# Altium schematic sheet RP2040 MCU.SchDoc
size A2; SheetNumber: 5; SheetTotal: 13
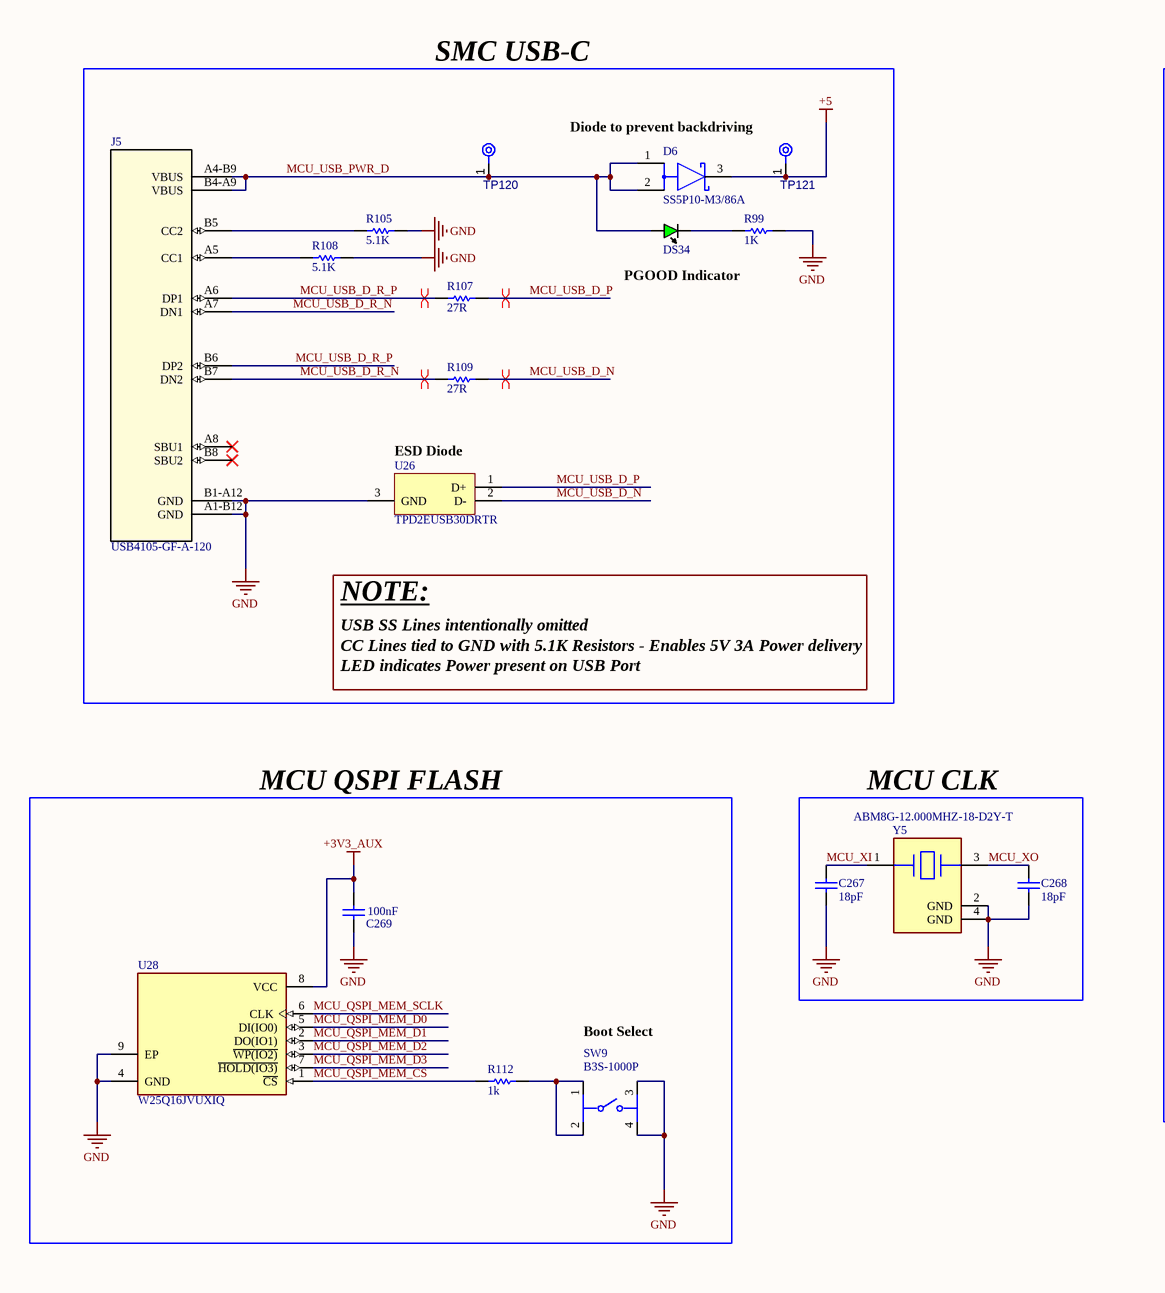
[diagram p0: RP2040 MCU.SchDoc, left]
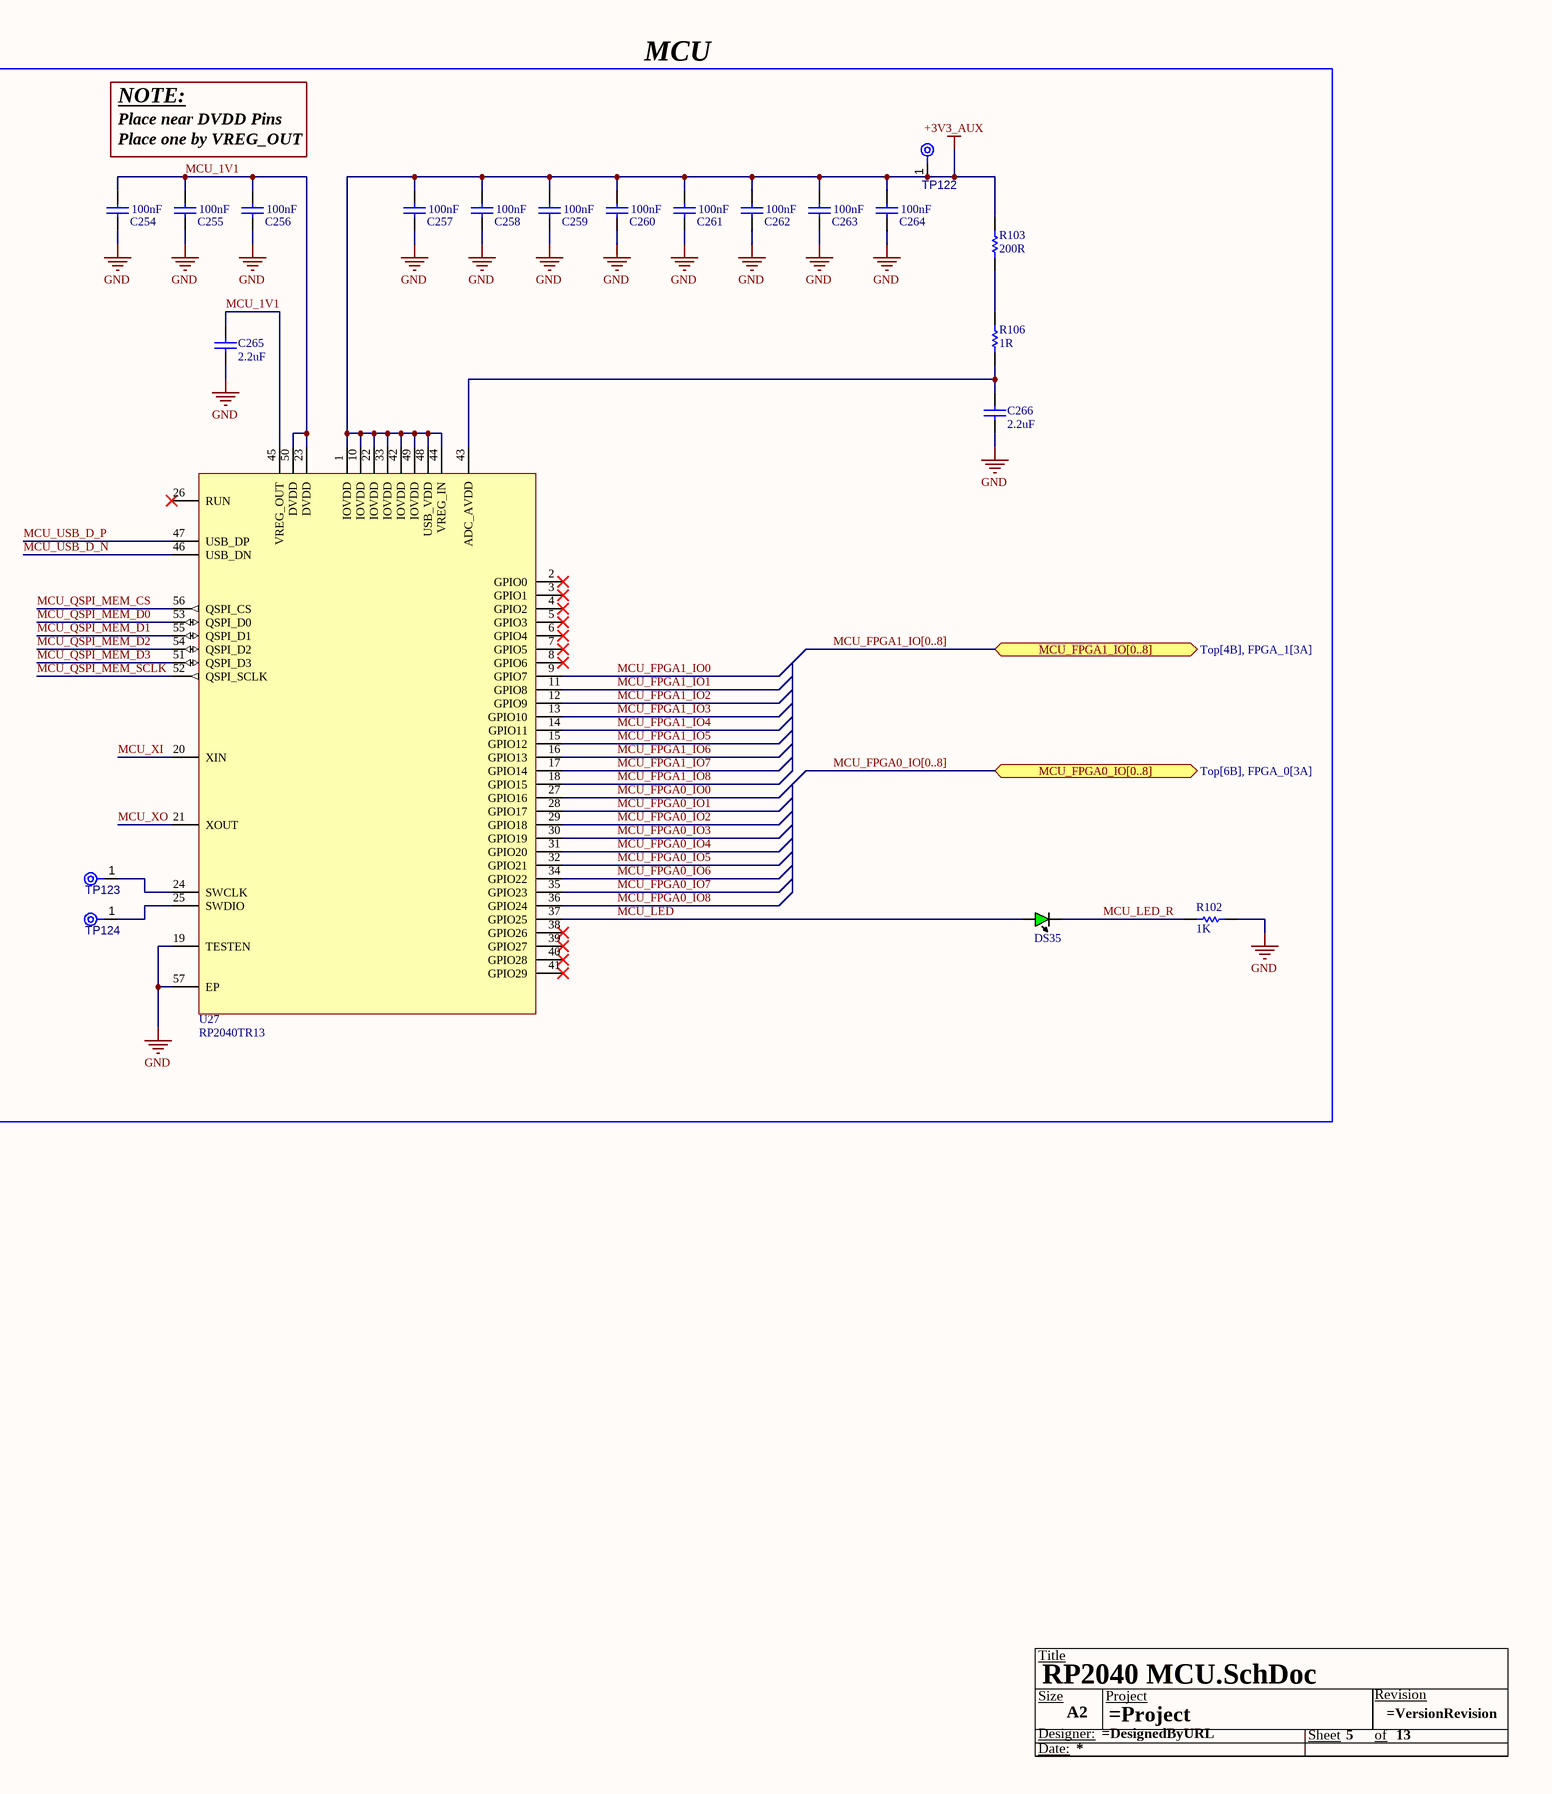
[diagram p1: RP2040 MCU.SchDoc, right]

## Parts
*  Size: A2  (hidden comment: Title Block)  (graphical)
C254  100nF  [CAPC1005X05N]
C255  100nF  [CAPC1005X05N]
C256  100nF  [CAPC1005X05N]
C257  100nF  [CAPC1005X05N]
C258  100nF  [CAPC1005X05N]
C259  100nF  [CAPC1005X05N]
C260  100nF  [CAPC1005X05N]
C261  100nF  [CAPC1005X05N]
C262  100nF  [CAPC1005X05N]
C263  100nF  [CAPC1005X05N]
C264  100nF  [CAPC1005X05N]
C265  2.2uF  [CAPC1005X55X25NL05T10]
C266  2.2uF  [CAPC1005X55X25NL05T10]
C267  18pF  [CAPC1005X55X25LL05T10]
C268  18pF  [CAPC1005X55X25LL05T10]
C269  100nF  [CAPC1005X05N]
D6  SS5P10-M3/86A  [FP-95570-MFG]
DS34  SMLLX0603GWTR  [LUMX-SML-LX0603_V]  (value not drawn)
DS35  SMLLX0603GWTR  [LUMX-SML-LX0603_V]  (value not drawn)
J5  USB4105-GF-A-120  [USB4105-GF-A-120-Footprint-1]
R99  1K  [RESC1005X40X25NL05T10]
R102  1K  [RESC1005X40X25NL05T10]
R103  200R  [RESC1005X40X25NL05T05]
R105  5.1K  [RESC1005X40X25NL05T10]
R106  1R  [RESC1005X40X25NL05T05]
R107  27R  [RESC1005X40X25NL05T10]
R108  5.1K  [RESC1005X40X25NL05T10]
R109  27R  [RESC1005X40X25NL05T10]
R112  value 1k  [RESC1005X40X25ML05T05]  (hidden comment: Resistor 1k +/-1% 0402 100 mW)
SW9  B3S-1000P  [FP-B3S-1000P-MFG]
TP120  TPAD6R  [TP06R]  (value not drawn)  (no BOM)
TP121  TPAD6R  [TP06R]  (value not drawn)  (no BOM)
TP122  TPAD6R  [TP06R]  (value not drawn)  (no BOM)
TP123  TPAD6R  [TP06R]  (value not drawn)  (no BOM)
TP124  TPAD6R  [TP06R]  (value not drawn)  (no BOM)
U26  TPD2EUSB30DRTR  [DRT0003A]
U27  RP2040TR13  [QFN40P700X700X80_HS-57N]
U28  W25Q16JVUXIQ  [FP-UX-MFG]
Y5  ABM8G-12.000MHZ-18-D2Y-T  [FP-ABM8G-MFG]

## Blocks framed on the sheet
MCU: C254-C266 DS35 R102 R103 R106 TP122-TP124 U27
MCU QSPI FLASH: C269 R112 SW9 U28
MCU CLK: C267 C268 Y5

## Ports
MCU_FPGA0_IO[0..8] (bidir, see Top[6B], FPGA_0[3A]), MCU_FPGA1_IO[0..8] (bidir, see Top[4B], FPGA_1[3A])

## Nets
+3V3_AUX: C257.2 C258.2 C259.2 C260.2 C261.2 C262.2 C263.2 C264.2 C269.2 R103.2 TP122.1(TP) U27.1(IOVDD) U27.10(IOVDD) U27.22(IOVDD) U27.33(IOVDD) U27.42(IOVDD) U27.44(VREG_IN) U27.48(USB_VDD) U27.49(IOVDD) U28.8(VCC)
+5: D6.3(C) TP121.1(TP)
GND: C254.1 C255.1 C256.1 C257.1 C258.1 C259.1 C260.1 C261.1 C262.1 C263.1 C264.1 C265.1 C266.1 C267.1 C268.1 C269.1 J5.A1-B12(GND) J5.B1-A12(GND) R99.1 R102.1 R105.2 R108.2 SW9.3 SW9.4 U26.3(GND) U27.19(TESTEN) U27.57(EP) U28.4(GND) U28.9(EP) Y5.2(GND) Y5.4(GND)
MCU_1V1: C254.2 C255.2 C256.2 C265.2 U27.23(DVDD) U27.45(VREG_OUT) U27.50(DVDD)
MCU_FPGA0_IO0: U27.27(GPIO16)
MCU_FPGA0_IO1: U27.28(GPIO17)
MCU_FPGA0_IO2: U27.29(GPIO18)
MCU_FPGA0_IO3: U27.30(GPIO19)
MCU_FPGA0_IO4: U27.31(GPIO20)
MCU_FPGA0_IO5: U27.32(GPIO21)
MCU_FPGA0_IO6: U27.34(GPIO22)
MCU_FPGA0_IO7: U27.35(GPIO23)
MCU_FPGA0_IO8: U27.36(GPIO24)
MCU_FPGA1_IO0: U27.9(GPIO7)
MCU_FPGA1_IO1: U27.11(GPIO8)
MCU_FPGA1_IO2: U27.12(GPIO9)
MCU_FPGA1_IO3: U27.13(GPIO10)
MCU_FPGA1_IO4: U27.14(GPIO11)
MCU_FPGA1_IO5: U27.15(GPIO12)
MCU_FPGA1_IO6: U27.16(GPIO13)
MCU_FPGA1_IO7: U27.17(GPIO14)
MCU_FPGA1_IO8: U27.18(GPIO15)
MCU_LED: DS35.1(A) U27.37(GPIO25)
MCU_LED_R: DS35.2(K) R102.2
MCU_QSPI_MEM_CS: R112.1 U27.56(QSPI_CS) U28.1(~{CS})
MCU_QSPI_MEM_D0: U27.53(QSPI_D0) U28.5(DI(IO0))
MCU_QSPI_MEM_D1: U27.55(QSPI_D1) U28.2(DO(IO1))
MCU_QSPI_MEM_D2: U27.54(QSPI_D2) U28.3(~{WP(IO2)})
MCU_QSPI_MEM_D3: U27.51(QSPI_D3) U28.7(~{HOLD(IO3)})
MCU_QSPI_MEM_SCLK: U27.52(QSPI_SCLK) U28.6(CLK)
MCU_USB_D_N: R109.2 U26.2(D-) U27.46(USB_DN)
MCU_USB_D_P: R107.2 U26.1(D+) U27.47(USB_DP)
MCU_USB_D_R_N: J5.A7(DN1) J5.B7(DN2) R109.1
MCU_USB_D_R_P: J5.A6(DP1) J5.B6(DP2) R107.1
MCU_USB_PWR_D: D6.1(A) D6.2(A) DS34.1(A) J5.A4-B9(VBUS) J5.B4-A9(VBUS) TP120.1(TP)
MCU_XI: C267.2 U27.20(XIN) Y5.1
MCU_XO: C268.2 U27.21(XOUT) Y5.3
NetC266_2: C266.2 R106.1 U27.43(ADC_AVDD)
NetDS34_2: DS34.2(K) R99.2
NetJ5_A5: J5.A5(CC1) R108.1
NetJ5_B5: J5.B5(CC2) R105.1
NetR103_1: R103.1 R106.2
NetR112_2: R112.2 SW9.1 SW9.2
NetTP123_1: TP123.1(TP) U27.24(SWCLK)
NetTP124_1: TP124.1(TP) U27.25(SWDIO)

Not connected (* = marked no-connect by the designer): J5 A8(SBU1)* B8(SBU2)*; U27 2(GPIO0)* 3(GPIO1)* 4(GPIO2)* 5(GPIO3)* 6(GPIO4)* 7(GPIO5)* 8(GPIO6)* 26(RUN)* 38(GPIO26)* 39(GPIO27)* 40(GPIO28)* 41(GPIO29)*

## Buses and harness runs
bus MCU_FPGA0_IO[0..8] = port MCU_FPGA0_IO[0..8]
bus MCU_FPGA1_IO[0..8] = port MCU_FPGA1_IO[0..8]

## Layout directives
differential pair: MCU_USB_D_N, MCU_USB_D_P, MCU_USB_D_R_N, MCU_USB_D_R_P

## Notes on the sheet
- SMC USB-C
- Diode to prevent backdriving
- Place near DVDD Pins
- NOTE:
- Place one by VREG_OUT
- PGOOD Indicator
- (near U26) ESD Diode
- USB SS Lines intentionally omitted
- CC Lines tied to GND with 5.1K Resistors - Enables 5V 3A Power delivery
- LED indicates Power present on USB Port
- Boot Select
- (in symbol CMP-007-000006-8) Title; Size; Project; Revision; Designer:; Sheet; of; Date:

## Library data of the parts
* = CMP-007-000006-8: Generic Title Block
C254-C264 C269 = CMP-001-00095-1: Cap Ceramic 0.1uF 50V X7R 20% SMD 0402 125°C Paper T/R GRM155R71H104ME14J; Voltage: 50V; Capacitance: 100nF; Case: 0402
C265 C266 = CMP-2008-04543-1: GRM155R60J225ME15D; Manufacturer: Murata; Part Number: GRM155R60J225ME15D
C267 C268 = CMP-2000-06328-1: Chip Capacitor, 18 pF, +/- 5%, 50 V, -55 to 125 degC, 0402 (1005 Metric), RoHS, Tape and Reel GRM1555C1H180JZ01D; Manufacturer: Murata; Other Names: 490-1281-6; Voltage - Rated: 50V; Temperature Coefficient: C0G,NP0; Catalog Drawings: GRMSeries_0402(0.5mmThickness); Applications: GeneralPurpose; Datasheet Version: 10/2016; Mounting Type: SurfaceMount,MLCC; Features: -; Package Reference: 0402; Thickness (Max): 0.022"(0.55mm); Capacitance: 18pF; Height - Seated (Max): -; Size / Dimension: 0.039"Lx0.020"W(1.00mmx0.50mm); Package / Case: 0402(1005Metric); Lead Style: -; Series: GRM; Mounting Technology: SurfaceMount; Package Description: 2-Pin Surface Mount Device, Body 1 x 0.5 mm; Family: CeramicCapacitors; Tolerance: ±5%; Category: Capacitors; Datasheet URL: http://psearch.en.murata.com/capacitor/product/GRM1555C1H180JZ01_.pdf; Ratings: -; Lead Spacing: -; Standard Package: 1; Operating Temperature: -55°C~125°C; Packaging: Digi-Reel®; Manufacturer URL: http://www.murata.com/
D6 = CMP-02539-000057-1: DIODE SCHOTTKY 100V 5A TO277A; Max Forward Surge Current (Ifsm): 150A; Element Configuration: Common Cathode; Max Reverse Leakage Current: 15uA; Forward Voltage: 880mV; Case/Package: TO-277A; Number of Pins: 3; Max Reverse Voltage (DC): 100V; Height: 0.031inch; Peak Non-Repetitive Surge Current: 150A; Series: eSMP®; Radiation Hardening: No; Length: 0.242inch; Max Repetitive Reverse Voltage (Vrrm): 100V; Forward Current: 5A; Width: 0.171inch; Min Operating Temperature: -55°C; Max Surge Current: 150A; Lead Free: Lead Free; RoHS Compliant: Yes; Average Rectified Current: 5A; Max Operating Temperature: 150°C; Max Reverse Current: 15uA; Package Quantity: 1500; Packaging: Tape and Reel; Mount: Surface Mount
DS34 DS35 = CMP-007-00037-1: LED GREEN DIFFUSED SMD; Color: Green; Case/Package: 0603
J5 = CMP-002-00073-2: USB CONN, 2.0 TYPE C, RCPT, 16POS, SMT; USB Connector Type: USB Type C; USB Standard: USB 2.0; Gender: Receptacle;...
R99 R102 = CMP-2002-03045-1: CRCW04021K00FKEDHP; Manufacturer: Vishay Dale; Part Number: CRCW04021K00FKEDHP
R103 = CMP-2002-08353-1: CRCW0402200RJNED; Manufacturer: Vishay Dale; Part Number: CRCW0402200RJNED
R105 R108 = CMP-2002-07753-1: RC0402FR-075K1L; Manufacturer: Yageo / Phycomp; Part Number: RC0402FR-075K1L
R106 = CMP-2002-08342-1: CRCW04021R00FKED; Manufacturer: Vishay Dale; Part Number: CRCW04021R00FKED
R107 R109 = CMP-1011-00036-2: RC0402JR-0727RL; Manufacturer: Yageo / Phycomp; Part Number: RC0402JR-0727RL
R112 = CMP-009-00009-4: Chip Resistor, 1 KOhm, +/- 1%, 0.1 W, -55 to 155 degC, 0402 (1005 Metric); Power: 100mW; Voltage Rating: 50V; Max Operating Temperature: 155°C; Min Operating Temperature: -55°C; RoHS Compliant: True; Case/Package: 0402; Mounting Technology: SM; Tolerance: 1%; Pins: 2
SW9 = CMP-08834-000008-1: SWITCH TACTILE SPST-NO 0.05A 24V; Throw Configuration: SPST; Switch Function: Off-Mom; Switch Travel: 0.25mm; Contact Current Rating: 50mA; Actuator Length: 0.8mm; Mechanical Life: 500000Cycles; Contact Resistance: 100mR; Operating Force: 1.57N; Actuator Type: Standard; Illumination Type: Non-Illuminated; Ratings: IP67; Number of Poles: 1; Package Quantity: 1; Orientation: Straight; REACH SVHC: No SVHC; Lead Free: Lead Free; Max Current Rating: 50mA; Contact Plating: Silver; Current Rating: 50mA; Depth: 9mm; Contact Material: Bronze; Electrical Life: 500000Cycles; Termination: Gull Wing; Width: 6mm; Packaging: Tape and Reel; Min Operating Temperature: -25°C; Radiation Hardening: No; Max Voltage Rating (DC): 24V; Max Operating Temperature: 70°C; Length: 6.6mm; Height: 3.65mm; Voltage Rating (DC): 24V; Weight: 0.010582oz; Mount: Surface Mount
TP120-TP124 = CMP-00028-00002-1: 0.6mm round; Pins: 1
U26 = CMP-0326-00046-3: ESD Solution for Super-Speed (6 Gbps) USB 3.0 Interface, 2 Channels, -40 to +85 degC, 3-pin SOT (DRT), Green (Rohs & No Sb/Br); Manufacturer: Texas Instruments; Differential Capacitance(pF): 0.01; Breakdown Voltage(Min)(V): 9; HDMI: TRUE; IEC 61000-4-2 Air-Gap(+/- kV): 8; IO Leakage Current(nA): 10; IO Capacitance(Typ)(pF): 0.7; Mounting Technology: Surface Mount; PackageDescription: 3-Flat Lead Plastic Small Outline, 1 x 1 mm (inc leads), 0.35 mm Pitch; IEC 61000-4-2 Contact(+/- kV): 8; USB Super Speed: TRUE; Eco-Plan: Green (RoHS & no Sb/Br); USB High Speed: TRUE; PackageReference: DRT0003A; SubFamily: ESD Solution; USB Full Speed: TRUE; ComponentLink1Description: Datasheet; ComponentLink2URL: SamplesURL:http://www.ti.com/product/tpd2eusb30#samples; PackageVersion: revD, Jun-2008; ComponentLink2Description: URL Link1; 1394 / Firewire: TRUE; PartNumber: TPD2EUSB30DRTR; ComponentLink1URL: http://www.ti.com/general/docs/lit/getliterature.tsp?genericPartNumber=TPD2EUSB30&fileType=pdf; DatasheetVersion: SLVSAC2C; Serial ATA / eSATA: TRUE
U27 = CMP-020-00027-1: Mcu, 32 Bit, 133MHZ, QFN-56;
U28 = CMP-78876-000011-1: IC FLASH 16MBIT SPI/QUAD 8USON; RoHS Compliant: Yes
Y5 = CMP-2000-05039-3: Crystal 12MHz ±20ppm (Tol) ±30ppm (Stability) 18pF FUND 120Ω 4-Pin SMD T/R; Series Resistance: 120R; Max Operating Temperature: 85°C; Mount: Surface Mount; Width: 2.5mm; Series: ABM8G; Termination: SMD/SMT; Frequency Tolerance: 20ppm; Tolerance: 20ppm; Min Operating Temperature: -40°C; Operating Frequency: 12 MHz; Depth: 2.5mm; Load Capacitance: 18pF; Number of Pins: 4; Length: 3.2mm; Radiation Hardening: No; Frequency Stability: 30ppm; Height: 1mm; Packaging: Tape and Reel; Package Quantity: 1000; ESR (Equivalent Series Resistance): 120R; Lead Free: Lead Free; Frequency: 12MHz; Case/Package: CSMD